# EAGLE design USBSocket_Type4_v1.0 (EAGLE 9.6.2)
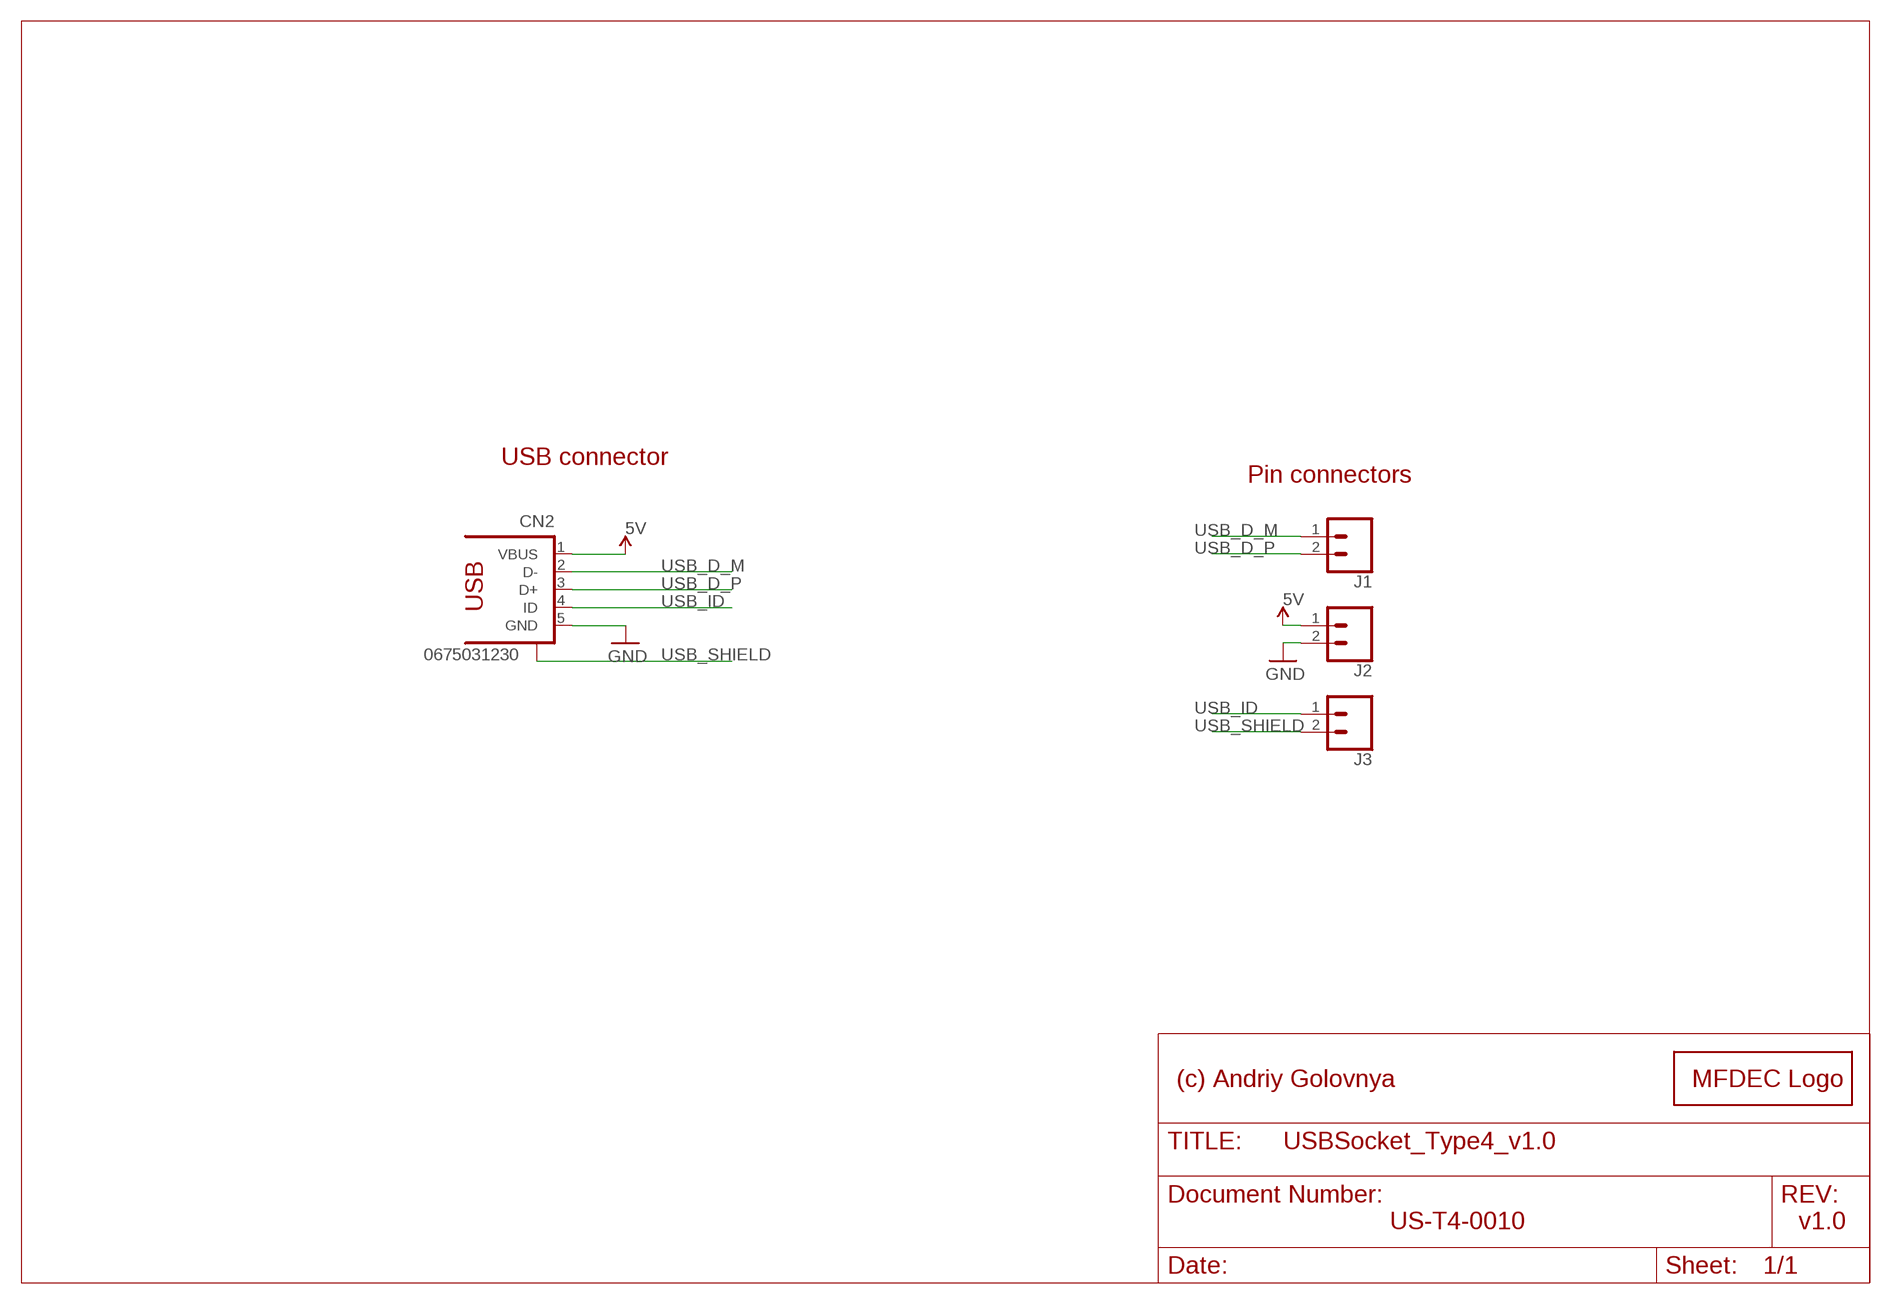
[diagram p0: schematic, sheet 1]

## Parts
CN2  0675031230  PMX42_56579-0576  [PMX42_56579-0576]
J1  CONN_02  [1X02]
J2  CONN_02  [1X02]
J3  CONN_02  [1X02]
LOGO1  MFDECLOGO_L_10MM  [MFDEC_L_10MM]

## Nets
5V [POWER]: CN2.1(VBUS) J2.1
GND [POWER]: CN2.5(GND) J2.2
USB_D_M [XUSB]: CN2.2(D-) J1.1
USB_D_P [XUSB]: CN2.3(D+) J1.2
USB_ID: CN2.4(ID) J3.1
USB_SHIELD: CN2.S1(S) CN2.S2(S) CN2.S3(S) CN2.S4(S) J3.2

## Notes on the sheet
- USB connector
- Pin connectors
- (c) Andriy Golovnya
- US-T4-0010 | v1.0

## Library data of the parts
CN2 = 52101-101-REV-A_v16:PMX42_56579-0576: USB - OTG, miniUSB Type AB, Molex
J1-J3 = SparkFun-Connectors:CONN_02: Multi connection point. Often used as Generic Header-pin footprint for 0.1 inch spaced/style header connections On any of the 0.1 inch spaced packages, you can populate with these: Break Away Headers - Straight <https://www.sparkfun.com/products/116> (PRT-00116) Break Away Male Headers - Right Angle <https://www.sparkfun.com/products/553> (PRT-00553) Female Headers <https://www.sparkfun.com/products/115> (PRT-00115) Break Away Headers - Machine Pin <https://www.sparkfun.com/products/117> (PRT-00117) Break Away Female Headers - Swiss Machine Pin <https://www.sparkfun.com/products/743> (PRT-00743) For SCREWTERMINALS and SPRING TERMINALS visit here: Screw Terimnals on SparkFun.com <https://www.sparkfun.com/search/results?term=Screw+Terminals> (5mm/3.5mm/2.54mm spacing) This device is also useful as a general connection point to wire up your design to another part of your project. Our various solder wires solder well into these plated through hole pads. Hook-Up Wire - Assortment (Stranded, 22 AWG) <https://www.sparkfun.com/products/11375> (PRT-11375) Hook-Up Wire - Assortment (Solid Core, 22 AWG) <https://www.sparkfun.com/products/11367> (PRT-11367) View the entire wire category on our website here <https://www.sparkfun.com/categories/141> Special notes: Molex polarized connector foot print use with: PRT-08233 with associated crimp pins and housings. 2.54_SCREWTERM for use with PRT-10571. 3.5mm Screw Terminal footprints for PRT-08084 5mm Screw Terminal footprints for use with PRT-08432
LOGO1 = _my_logos:MFDECLOGO: Midnight Fog - Digital Eye Candy LOGO

## Net classes
1 XUSB: width 0.305 mm
2 USB: width 0.305 mm
3 POWER: width 0.305 mm

## Board
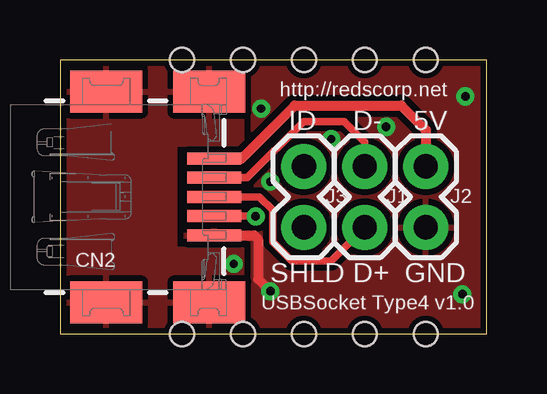
[diagram p1: board, top side]
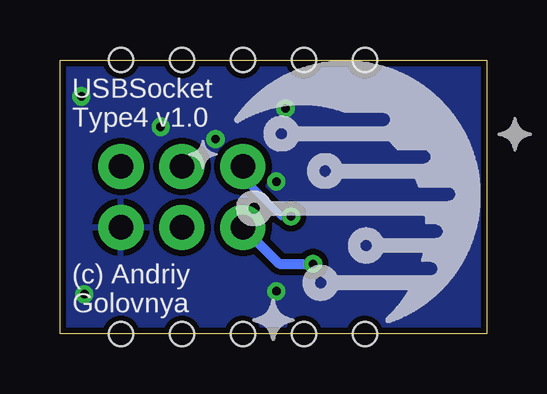
[diagram p2: board, bottom side, seen from below]

Size 17.78 x 11.43 mm. Coordinates in mm from the lower left corner, seen from the top.
Outline: 0,0 17.78,0 17.78,11.43 0,11.43 0,0
Copper layers (1*16): Top 0.035mm / dielectric 1.5mm / Bottom 0.035mm
Design rules "default *": minimum track width 6mil, minimum drill 0.35mm, track to track 6mil, track to pad 6mil, pad to pad 6mil, via to via 6mil, smd to smd 6mil, copper to edge 10mil, drill to drill 6mil, minimum pad ring 10mil, minimum via ring 8mil, stop-mask expansion 4mil, vias tented up to drill 20mil, thermal gap 10mil
Holes 1 mm at 15.24,0 12.7,0 10.16,0 7.62,0 5.08,0 5.08,11.43 7.62,11.43 10.16,11.43 12.7,11.43 15.24,11.43

### Footprints (pad centres in the part's own frame; a part is rotated, then mirrored left to right if it is on the bottom)
PMX42_56579-0576 = smd 0.5 x 2.25: 1 1.6,-0.2; 2 0.8,-0.2; 3 0,-0.2; 4 -0.8,-0.2; 5 -1.6,-0.2 | smd 1.75 x 3: S1 -4.4,0; S2 4.4,0; S3 -4.4,4.3; S4 4.4,4.3
1X02 = drill 1.016 pad 1.88: 1 0,0; 2 2.54,0

### Placement (x,y rotation side)
CN2  6.22,5.71 90 top
J1  12.7,6.99 270 top
J2  15.24,6.99 270 top
J3  10.16,6.99 270 top
LOGO1  -2.67,12.32 180 bottom

### Tracks (layer width: path | path; a pad name or v marks a point on that pad's centre or on a via)
5V
  Top 0.406: J2.1 15.24,8.51 14.22,9.53 9.78,9.53 7.57,7.32 CN2.1
GND  (via drill 0.35)
  Top 0.406: CN2.5 8.08,4.12 8.26,3.94 8.26,2.29 v8.76,1.78
  other vias: 11.3,8.13 8.38,9.4 16.76,1.65 16.89,9.91 8.76,6.35 13.59,8.64
  pour Top (isolate 0.254, rank 2): 0,0 23.88,0 23.88,11.43 0,11.43
  pour Bottom (isolate 0.254, rank 2): 0,0 20.57,0 20.57,11.43 0,11.43
USB_D_M
  Top 0.305: J1.1 12.7,8 11.84,8.87 10.15,8.87 7.8,6.51 CN2.2
USB_D_P
  Top 0.305: J1.2 11.3,3.05 9.65,3.05 8.86,3.84 8.86,5.16 8.31,5.71 CN2.3
USB_ID  (via drill 0.35)
  Top 0.305: CN2.4 v8.14,4.92 v8.15,4.91
  Bottom 0.305: J3.1 10.16,6.53 8.53,4.91 v8.15,4.91
USB_SHIELD  (via drill 0.35)
  Bottom 0.406: J3.2 8.64,2.92 v7.24,2.92
  pour Top (isolate 0.254): 4.83,7.87 7.62,7.87 7.62,11.43 0,11.43 0,0 7.62,0 7.62,3.56 4.83,3.56

### Text on the board
tPlace: http://redscorp.net | ID | D- | 5V | SHLD | D+ | GND | USBSocket Type4 v1.0
bPlace: USBSocket / Type4 v1.0 | (c) Andriy / Golovnya